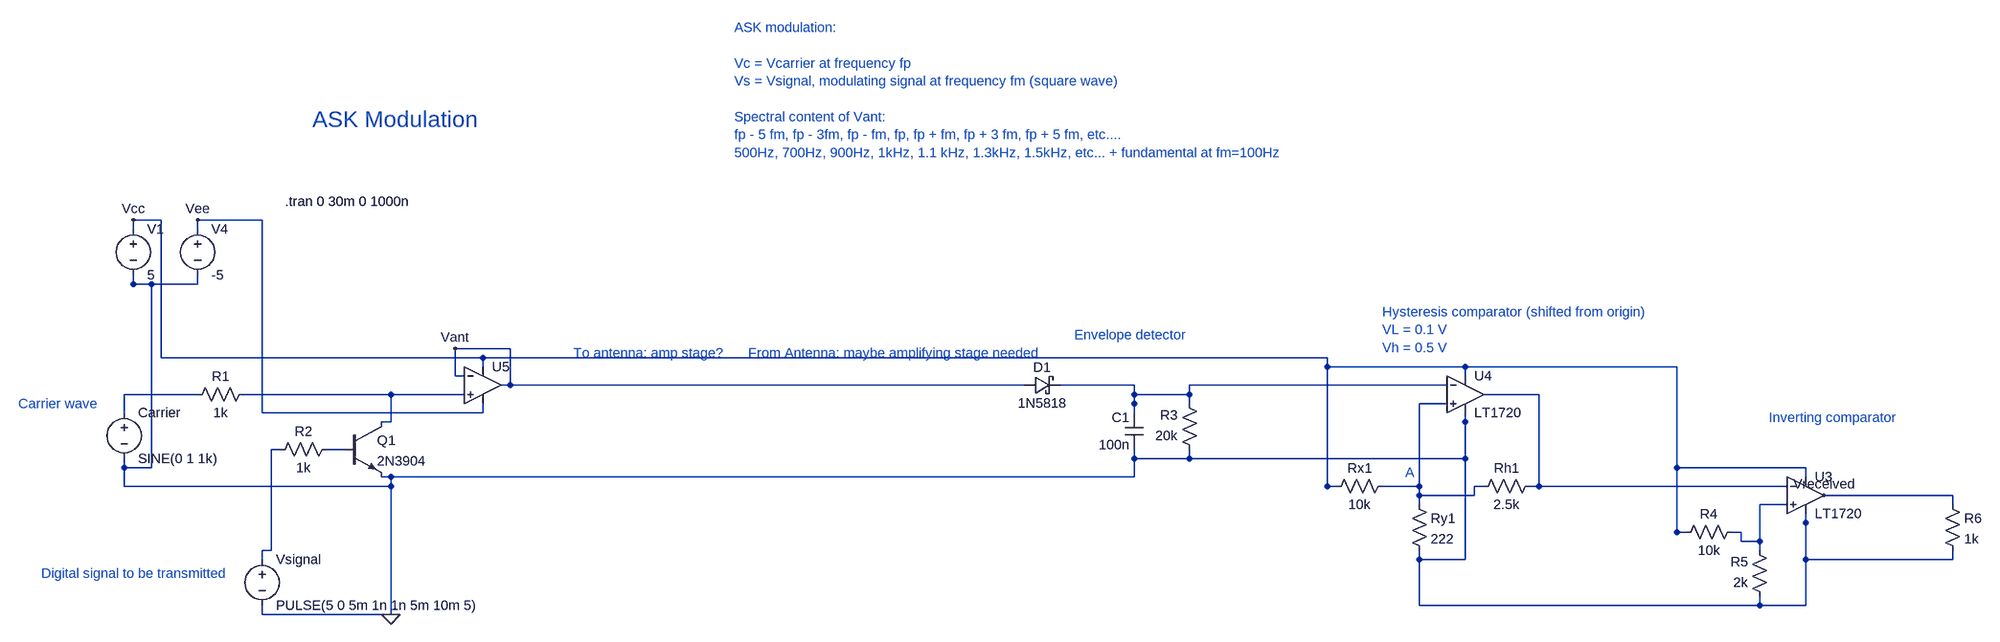
[diagram p0: schematic ASK-modulation.asc]
ASK-modulation.asc, the LTspice schematic file:
Version 4.1
SHEET 1 3624 680
WIRE 1184 304 1184 320
WIRE -672 320 -672 336
WIRE -224 352 -208 352
WIRE 1280 304 1280 320
WIRE 2272 560 2272 576
WIRE 2608 480 2608 496
WIRE 1680 480 1680 496
WIRE 2352 416 2352 432
WIRE 1760 240 1760 256
WIRE -656 0 -656 16
WIRE -544 0 -544 16
WIRE -432 576 -432 592
WIRE 1184 320 1280 320
WIRE 1280 320 1760 320
WIRE 1760 320 1760 256
WIRE 1760 256 1760 496
WIRE 1760 496 1680 496
WIRE 1680 496 1680 576
WIRE 1680 576 2272 576
WIRE 2272 576 2352 576
WIRE 2352 576 2352 432
WIRE 2352 432 2352 496
WIRE 2352 496 2608 496
WIRE 1184 320 1184 352
WIRE 1184 352 -208 352
WIRE -208 352 -208 592
WIRE -208 592 -432 592
WIRE -208 352 -208 368
WIRE -208 368 -672 368
WIRE -672 368 -672 336
WIRE -672 336 -624 336
WIRE -624 336 -624 16
WIRE -624 16 -656 16
WIRE -656 16 -544 16
FLAG -208 592 0
WIRE 1184 240 1184 224
WIRE 1056 192 1072 192
WIRE 1280 224 1280 208
WIRE 1728 192 1712 192
WIRE 1184 224 1184 208
WIRE 1184 208 1280 208
WIRE 1184 224 1184 192
WIRE 1184 192 1072 192
WIRE 1280 208 1280 192
WIRE 1280 192 1712 192
WIRE -672 240 -672 224
WIRE -544 208 -560 208
WIRE -672 224 -672 208
WIRE -672 208 -560 208
WIRE -224 256 -208 256
WIRE -464 208 -448 208
WIRE -80 208 -96 208
WIRE -208 256 -208 208
WIRE -208 208 -96 208
WIRE -208 208 -448 208
WIRE 1872 368 1888 368
WIRE 2320 368 2304 368
WIRE 1792 208 1808 208
WIRE 1888 368 1888 208
WIRE 1888 208 1808 208
WIRE 1888 368 2304 368
WIRE 1792 368 1776 368
WIRE 1616 368 1632 368
WIRE 1680 400 1680 384
WIRE 1728 224 1712 224
WIRE 1776 368 1776 384
WIRE 1776 384 1680 384
WIRE 1680 384 1680 368
WIRE 1680 368 1632 368
WIRE 1680 384 1680 224
WIRE 1680 224 1712 224
WIRE -400 304 -416 304
WIRE -432 496 -432 480
WIRE -416 304 -416 480
WIRE -416 480 -432 480
WIRE -288 304 -304 304
WIRE -320 304 -304 304
WIRE 2224 448 2240 448
WIRE 2272 480 2272 464
WIRE 2320 400 2304 400
WIRE 2240 448 2240 464
WIRE 2240 464 2272 464
WIRE 2272 464 2272 400
WIRE 2272 400 2304 400
WIRE 992 192 976 192
WIRE -80 176 -96 176
WIRE -16 192 0 192
WIRE 976 192 0 192
WIRE 0 192 0 128
WIRE 0 128 -96 128
WIRE -96 128 -96 176
FLAG -96 128 Vant
WIRE 2144 448 2128 448
WIRE 1536 368 1520 368
WIRE 2352 352 2352 336
WIRE 1760 176 1760 160
WIRE -48 160 -48 144
WIRE -656 -80 -656 -96
WIRE 2128 448 2128 336
WIRE 2128 336 2352 336
WIRE 2128 448 2128 160
WIRE 2128 160 1760 160
WIRE 1760 160 1520 160
WIRE 1520 160 1520 368
WIRE 1520 368 1520 144
WIRE 1520 144 -48 144
WIRE -48 144 -608 144
WIRE -608 144 -608 -96
WIRE -608 -96 -656 -96
FLAG -656 -96 Vcc
WIRE -48 224 -48 240
WIRE -544 -80 -544 -96
WIRE -48 240 -432 240
WIRE -432 240 -432 -96
WIRE -432 -96 -544 -96
FLAG -544 -96 Vee
WIRE 2608 400 2608 384
WIRE 2384 384 2400 384
WIRE 2608 384 2400 384
FLAG 2384 384 Vreceived
SYMBOL voltage -656 -96 R0
WINDOW 123 0 0 Left 0
WINDOW 39 0 0 Left 0
SYMATTR InstName V1
SYMATTR Value 5
SYMBOL voltage -672 224 R0
WINDOW 123 0 0 Left 0
WINDOW 39 0 0 Left 0
SYMATTR InstName Carrier
SYMATTR Value SINE(0 1 1k)
SYMBOL res -448 192 R90
WINDOW 0 0 56 VBottom 2
WINDOW 3 32 56 VTop 2
SYMATTR InstName R1
SYMATTR Value 1k
SYMBOL npn -288 256 R0
SYMATTR InstName Q1
SYMATTR Value 2N3904
SYMBOL voltage -432 480 R0
WINDOW 123 0 0 Left 0
WINDOW 39 0 0 Left 0
SYMATTR InstName Vsignal
SYMATTR Value PULSE(5 0 5m 1n 1n 5m 10m 5)
SYMBOL voltage -544 -96 R0
WINDOW 123 0 0 Left 0
WINDOW 39 0 0 Left 0
SYMATTR InstName V4
SYMATTR Value -5
SYMBOL res -304 288 R90
WINDOW 0 0 56 VBottom 2
WINDOW 3 32 56 VTop 2
SYMATTR InstName R2
SYMATTR Value 1k
SYMBOL res 1296 320 R180
WINDOW 0 36 76 Left 2
WINDOW 3 36 40 Left 2
SYMATTR InstName R3
SYMATTR Value 20k
SYMBOL cap 1200 304 R180
WINDOW 0 24 56 Left 2
WINDOW 3 24 8 Left 2
SYMATTR InstName C1
SYMATTR Value 100n
SYMBOL res 1632 352 R90
WINDOW 0 0 56 VBottom 2
WINDOW 3 32 56 VTop 2
SYMATTR InstName Rx1
SYMATTR Value 10k
SYMBOL res 1664 384 R0
SYMATTR InstName Ry1
SYMATTR Value 222
SYMBOL res 1888 352 R90
WINDOW 0 0 56 VBottom 2
WINDOW 3 32 56 VTop 2
SYMATTR InstName Rh1
SYMATTR Value 2.5k
SYMBOL Comparators\\LT1720 1760 144 R0
SYMATTR InstName U4
SYMBOL Comparators\\LT1720 2352 320 R0
SYMATTR InstName U3
SYMBOL res 2240 432 R90
WINDOW 0 0 56 VBottom 2
WINDOW 3 32 56 VTop 2
SYMATTR InstName R4
SYMATTR Value 10k
SYMBOL res 2288 576 R180
WINDOW 0 36 76 Left 2
WINDOW 3 36 40 Left 2
SYMATTR InstName R5
SYMATTR Value 2k
SYMBOL res 2592 384 R0
SYMATTR InstName R6
SYMATTR Value 1k
SYMBOL Opamps\\UniversalOpamp2 -48 192 R0
SYMATTR InstName U5
SYMBOL schottky 992 208 R270
WINDOW 0 32 32 VTop 2
WINDOW 3 0 32 VBottom 2
SYMATTR InstName D1
SYMATTR Value 1N5818
SYMATTR Description Diode
SYMATTR Type diode
TEXT -344 -272 Left 4 ;ASK Modulation
TEXT -392 -128 Left 2 !.tran 0 30m 0 1000n
TEXT 208 136 Left 2 ;To antenna: amp stage?
TEXT 1656 344 Left 2 ;A
TEXT -856 224 Left 2 ;Carrier wave
TEXT -816 520 Left 2 ;Digital signal to be transmitted
TEXT 512 136 Left 2 ;From Antenna: maybe amplifying stage needed
TEXT 1080 104 Left 2 ;Envelope detector
TEXT 1616 64 Left 2 ;Hysteresis comparator (shifted from origin)\nVL = 0.1 V\nVh = 0.5 V
TEXT 2288 248 Left 2 ;Inverting comparator
TEXT 488 -432 Left 2 ;ASK modulation:\n \nVc = Vcarrier at frequency fp\nVs = Vsignal, modulating signal at frequency fm (square wave)\n \nSpectral content of Vant:\nfp - 5 fm, fp - 3fm, fp - fm, fp, fp + fm, fp + 3 fm, fp + 5 fm, etc....\n500Hz, 700Hz, 900Hz, 1kHz, 1.1 kHz, 1.3kHz, 1.5kHz, etc... + fundamental at fm=100Hz

The netlist it stands for:
* ASK-modulation.asc
V1 Vcc 0 5
V§Carrier N002 0 SINE(0 1 1k)
R1 N003 N002 1k
Q1 N003 N007 0 0 2N3904
Vsignal N006 0 PULSE(5 0 5m 1n 1n 5m 10m 5)
V4 Vee 0 -5
R2 N007 N006 1k
R3 0 N001 20k
C1 0 N001 100n
Rx1 N005 Vcc 10k
Ry1 N005 0 222
Rh1 N004 N005 2.5k
X§U4 N005 N001 Vcc 0 N004 LT1720  ; pins In+ In- V+ V- OUT
X§U3 N008 N004 Vcc 0 Vreceived LT1720  ; pins In+ In- V+ V- OUT
R4 N008 Vcc 10k
R5 0 N008 2k
R6 Vreceived 0 1k
X§U5 N003 Vant Vcc Vee Vant level.2 Avol=1Meg GBW=10Meg Slew=10Meg ilimit=25m rail=0 Vos=0 phimargin=45 en=0 enk=0 in=0 ink=0 Rin=500Meg  ; pins IN+ IN- V+ V- OUT
D1 Vant N001 1N5818
.model D D
.lib standard.dio
.model NPN NPN
.model PNP PNP
.lib standard.bjt
* ASK Modulation
.tran 0 30m 0 1000n
* To antenna: amp stage?
* A
* Carrier wave
* Digital signal to be transmitted
* From Antenna: maybe amplifying stage needed
* Envelope detector
* Hysteresis comparator (shifted from origin)
* VL = 0.1 V
* Vh = 0.5 V
* Inverting comparator
* ASK modulation:
* Vc = Vcarrier at frequency fp
* Vs = Vsignal, modulating signal at frequency fm (square wave)
* Spectral content of Vant:
* fp - 5 fm, fp - 3fm, fp - fm, fp, fp + fm, fp + 3 fm, fp + 5 fm, etc....
* 500Hz, 700Hz, 900Hz, 1kHz, 1.1 kHz, 1.3kHz, 1.5kHz, etc... + fundamental at fm=100Hz
.lib LT1720.sub
.lib UniversalOpamps2.sub
.backanno
.end